# Altium project admin_light_1-0.PrjPcb
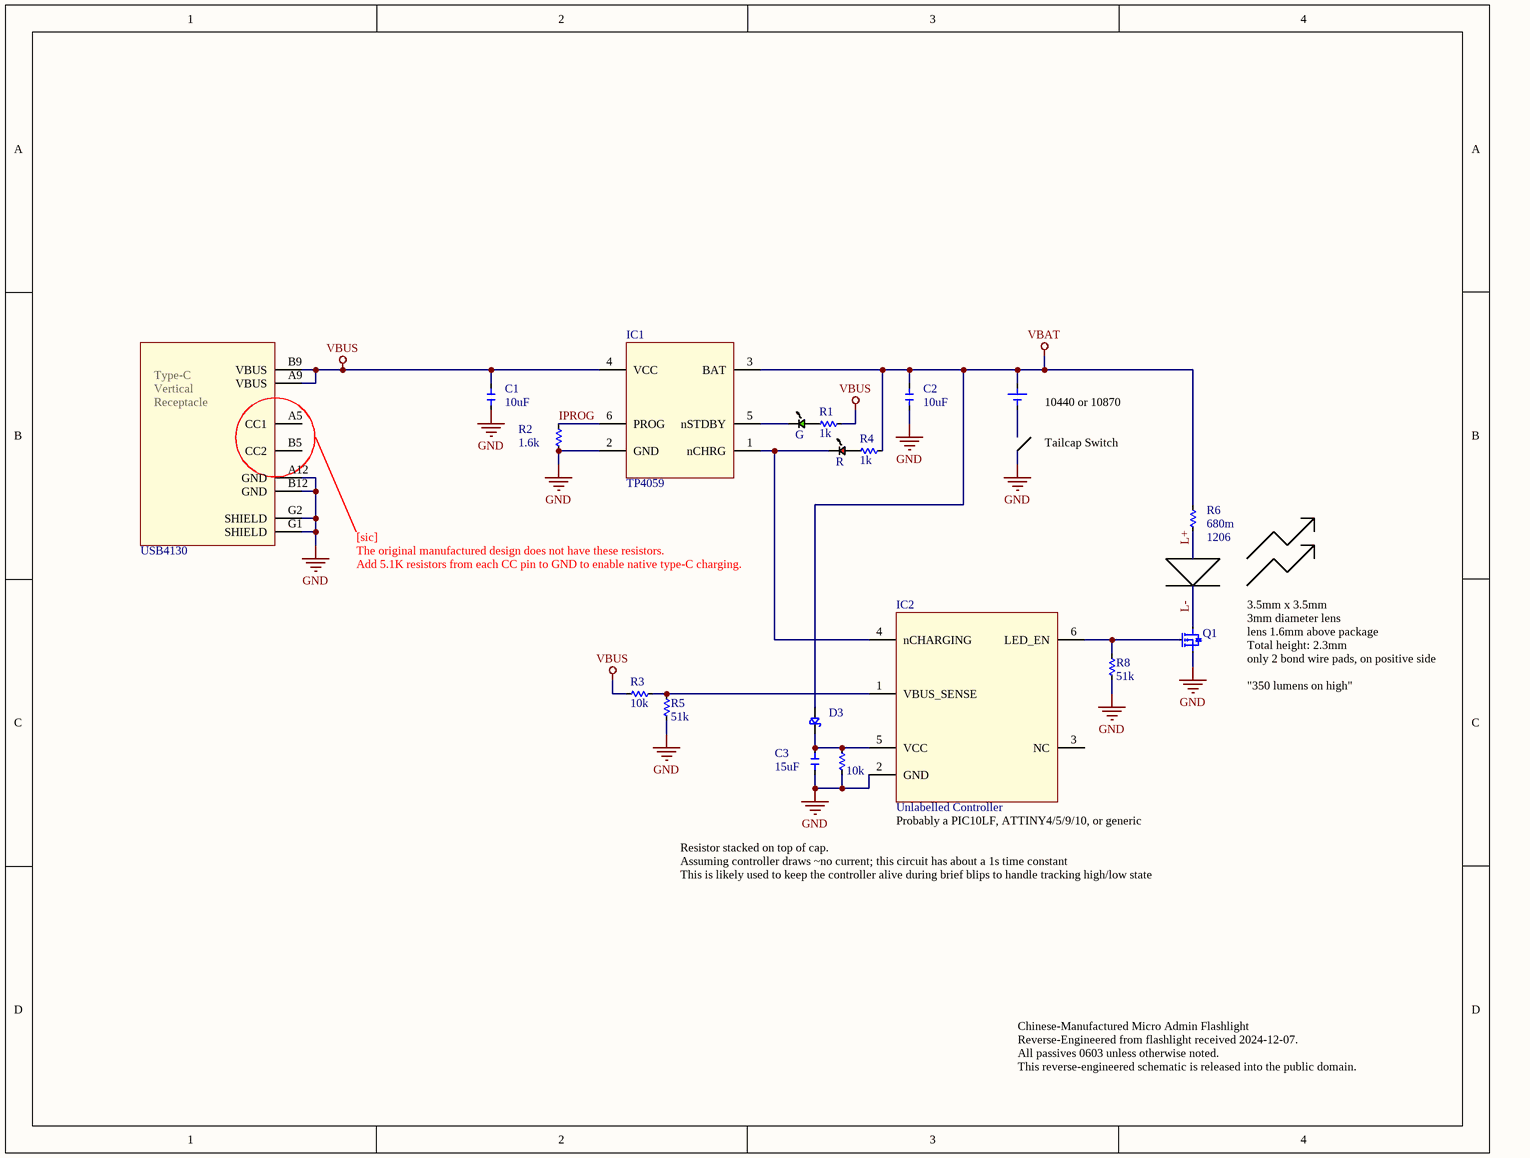
[diagram p0: admin_light.SchDoc]
1 sheet, 19 parts. Net scope: strictly hierarchical (ports join the sheet entries above them; power ports are local).

## Sheet admin_light.SchDoc
size Letter; DocumentNumber: 1; SheetNumber: 1; SheetTotal: 1

### Parts
?  Resistance: 10k  [R0603_0.55MM]  (hidden comment: RC0603FR-0710KL)
BT1  1095P  [BAT_KEYSTONE_1095P]  (value not drawn)
C1  Capacitance: 10uF
C2  Capacitance: 10uF
C3  Capacitance: 15uF
CN?  USB4130
D3  NRVB120VLSFT1G  [SOD123FL_ONSEMI]  (value not drawn)
G  LTST-C193TGKT-5A  [LTST-C193TGKT-5A]  (value not drawn)
IC1  TP4059  [SOT95P290X125-6L]
IC2  Unlabelled Controller
Q1  (no value)
R  LTST-C193KRKT-2A  [LTST-C193KRKT-2A]  (value not drawn)
R1  Resistance: 1k  [R0603_0.55MM]  (hidden comment: RC0603FR-071KL)
R2  Resistance: 1.6k  [R0603_0.55MM]  (hidden comment: RC0603FR-071K6L)
R3  Resistance: 10k  [R0603_0.55MM]  (hidden comment: RC0603FR-0710KL)
R4  Resistance: 1k  [R0603_0.55MM]  (hidden comment: RC0603FR-071KL)
R5  Resistance: 51k  [R0603_0.55MM]  (hidden comment: RC0603FR-0751KL)
R6  Resistance: 680m  Footprint: 1206
R8  Resistance: 51k  [R0603_0.55MM]  (hidden comment: RC0603FR-0751KL)

### Nets
GND: ?.2 C1.2 C2.2 C3.2 CN?.A12(GND) CN?.B12(GND) CN?.G1(SHIELD) CN?.G2(SHIELD) IC1.2(GND) IC2.2(GND) Q1.2 R2.2 R5.2 R8.2
VBAT: BT1.P C2.1 D3.2 IC1.3(BAT) R4.1 R6.1
VBUS: C1.1 CN?.A9(VBUS) CN?.B9(VBUS) IC1.4(VCC) R1.1 R3.1
IPROG: IC1.6(PROG) R2.1  [project net IPROG_1]
L+: R6.2  [project net L+_1]
L-: Q1.3  [project net L-_1]
Net?_1: ?.1 C3.1 D3.1 IC2.5(VCC)
NetG_1: G.1 IC1.5(nSTDBY)
NetG_2: G.2 R1.2
NetIC1_1: IC1.1(nCHRG) IC2.4(nCHARGING) R.1
NetIC2_1: IC2.1(VBUS_SENSE) R3.2 R5.1
NetIC2_6: IC2.6(LED_EN) Q1.1 R8.1
NetR_2: R.2 R4.2

Not connected (* = marked no-connect by the designer): BT1 N(_); CN? A5(CC1) B5(CC2); IC2 3(NC)

### Notes on the sheet
- (near BT1) 10440 or 10870
- (near BT1) Tailcap Switch
- [sic]
- The original manufactured design does not have these resistors.
- Add 5.1K resistors from each CC pin to GND to enable native type-C charging.
- 3.5mm x 3.5mm
- 3mm diameter lens
- lens 1.6mm above package
- Total height: 2.3mm
- only 2 bond wire pads, on positive side
- "350 lumens on high"
- (near IC2) Probably a PIC10LF, ATTINY4/5/9/10, or generic
- Resistor stacked on top of cap.
- Assuming controller draws ~no current; this circuit has about a 1s time constant
- This is likely used to keep the controller alive during brief blips to handle tracking high/low state
- Chinese-Manufactured Micro Admin Flashlight
  Reverse-Engineered from flashlight received 2024-12-07.
  All passives 0603 unless otherwise noted.
  This reverse-engineered schematic is released into the public domain.
- (in symbol USB4130) Type-C; Vertical; Receptacle

### Library data of the parts
? R3 = resistor_standard_1173: RES SMD 10K OHM 1% 1/10W 0603; Manufacturer: Yageo; Unit Price (USD): 0.1; Power (Watts): 0.1W, 1/10W; Temperature Coefficient: ±100ppm/°C; Key: resistor_standard_1173; ComponentLink1Description: Series Datasheet; ComponentLink1URL: https://www.yageo.com/upload/media/product/productsearch/datasheet/rchip/PYu-RC_Group_51_RoHS_L_10.pdf; Digi-Key Part Number: 311-10.0KHRCT-ND; Manufacturer Part Number: RC0603FR-0710KL; Series: RC; Value: 10k; Tolerance: ±1%; Composition: Thick Film; Features: Moisture Resistant; Operating Temperature: -55°C ~ 155°C; Package / Case: 0603 (1608 Metric); Supplier Device Package: 603; Size / Dimension: 0.063" L x 0.031" W (1.60mm x 0.80mm); Height - Seated (Max): 0.022" (0.55mm)
BT1 = BATT_HOLDER_18350_1095P: Cylindrical Battery Contacts, Clips, Holders & Springs 18350 HOLDER THM POLARIZED; Manufacturer: Keystone Electronics; Number of Cells: 1; Battery Size: 18350; Supplier 1: Digikey; Manufacturer Part Number: 1095P; RoHS: Yes; Category: Batteries and Accessories; Stock 1: 467; Pricing 1: 1=3.26, 25=2.7448, 100=2.2695, 250=2.08576, 500=1.95606, 1000=1.82638, 2500=1.65347, 5000=1.49137 (USD); Mounting Technology: Through Hole,PCB; Min Operating Temperature: -50°C; Max Operating Temperature: 145°C; Termination: PC Pin; Series: -; ComponentLink1URL: https://www.keyelco.com/userAssets/file/M65p26.pdf; ComponentLink1Description: Datasheet; Supplier Part Number 1: 36-1095P-ND
C1-C3 = 2pin_nonpolar_capacitor
D3 = DIODE_SCHOTTKY_20V_1A_NRVB120VLSFT1G: Diode Schottky Si 20V 1A Automotive 2-Pin SOD-123FL T/R; Manufacturer: ON Semiconductor; Max Reverse Current: 15mA; Peak Non-Repetitive Surge Current: 45A; Supplier 1: Digikey; Manufacturer Part Number: NRVB120VLSFT1G; RoHS: Yes; Category: Schottky Diodes; Stock 1: 18580; Pricing 1: 1=0.76, 10=0.474, 100=0.3058, 500=0.2331, 1000=0.20965, 3000=0.17979, 6000=0.16473, 9000=0.15705, 15000=0.14842, 21000=0.1433, 30000=0.13832 (USD); Mounting Technology: Surface Mount; Case/Package: SOD; Pins: 2; Min Operating Temperature: -65°C; Max Operating Temperature: 125°C; Packaging: Tape and Reel; Average Rectified Current: 1A; Max Repetitive Reverse Voltage (Vrrm): 20V; Max Reverse Voltage (DC): 20V; Series: Automotive, AEC-Q101; Lead Free: Lead Free; RoHS Compliant: Yes; ComponentLink3URL: http://www.onsemi.com/pub/Collateral/MBR120VLSFT1-D.PDF?src-supplier=Digikey; ComponentLink3Description: Datasheet; Supplier Part Number 1: NRVB120VLSFT1GOSCT-ND
G = LED_GREEN_0603_LTST-C193TGKT-5A: Green 1.6 x 0.8 x 0.8 mm 280 mcd 3.1 V Water Clear Ultra Bright InGaN Chip LED; Manufacturer: Vishay Lite-On; Lens Color: Colorless; Forward Current: 5mA; Forward Voltage: 3.1V; Luminous Intensity: 280mcd; Viewing Angle: 130°; Lens Style: Diffused,Colorless,Rectangular; Dominant Wavelength: 528nm; Number of LEDs: 1; Wavelength: 535nm; Supplier 1: Digikey; Manufacturer Part Number: LTST-C193TGKT-5A; RoHS: Yes; Category: LEDs; Stock 1: 106542; Pricing 1: 1=0.5, 10=0.289, 100=0.1844, 500=0.14328, 1000=0.13069, 2000=0.12039, 5000=0.10957, 10000=0.10307, 15000=0.09983, 25000=0.09625, 35000=0.09416, 50000=0.09216 (USD); Mounting Technology: Surface Mount; Case/Package: 0603; Pins: 2; Color: Green; Case Code (Metric): 1608; Case Code (Imperial): 0603; Min Operating Temperature: -20°C; Max Operating Temperature: 80°C; Illumination Color: Green; Packaging: Tape and Reel; Package Quantity: 3000; Lens Transparency: Clear; Test Current: 5mA; Series: -; Length: 1.6mm; Width: 0.8mm; Height: 0.35mm; Radiation Hardening: No; Lead Free: Lead Free; RoHS Compliant: Yes; ComponentLink1URL: https://datasheet.ciiva.com/2111/ltst-c193tgkt-5a-2111818.pdf?src-supplier=Digikey; ComponentLink1Description: Datasheet; Supplier Part Number 1: 160-1832-1-ND
IC1 = BATT_CHARGER_LINEAR_TP4059: Manufacturer: TOPPOWER; Supplier 1: LCSC; Manufacturer Part Number: TP4059; RoHS: No; Stock 1: 510; Pricing 1: 5=0.1109, 50=0.0894, 150=0.0786, 500=0.0706, 3000=0.0609, 6000=0.0576 (USD); Supplier Part Number 1: C80364; ComponentLink1Description: Datasheet; ComponentLink1URL: http://toppwr.com/uploadfile/file/20240913/66e3a53c397cc.pdf
IC2 = mystery_controller
Q1 = _generic_nfet
R = LED_RED_0603_LTST-C193KRKT-2A: Led 0603 Red 629NM 11MCD 2MA; Manufacturer: Vishay Lite-On; Lens Color: Colorless; Viewing Angle: 130°; Lens Style: Flat; Lens Transparency: Clear; Luminous Intensity: 6.5mcd; Forward Voltage: 1.9V; Lens Size: 0.8mm; Supplier 1: Digikey; Manufacturer Part Number: LTST-C193KRKT-2A; RoHS: Yes; Category: LEDs; Stock 1: 100428; Pricing 1: 1=0.28, 10=0.159, 100=0.0967, 500=0.07258, 1000=0.06521, 2000=0.05917 (USD); Mounting Technology: Surface Mount; Case/Package: 0603; Color: Red; Case Code (Metric): 1608; Case Code (Imperial): 0603; Packaging: Cut Tape; Test Current: 2mA; Dominant Wavelength: 629nm; Series: -; Length: 1.6mm; Width: 0.8mm; Height: 0.35mm; RoHS Compliant: Yes; ComponentLink1URL: https://datasheet.ciiva.com/6348/ltst-c193krkt-2a-6348473.pdf?src-supplier=Digikey; ComponentLink1Description: Datasheet; Supplier Part Number 1: 160-1909-1-ND
R1 R4 = resistor_standard_1131: RES SMD 1K OHM 1% 1/10W 0603; Manufacturer: Yageo; Unit Price (USD): 0.1; Power (Watts): 0.1W, 1/10W; Temperature Coefficient: ±100ppm/°C; Key: resistor_standard_1131; ComponentLink1Description: Series Datasheet; ComponentLink1URL: https://www.yageo.com/upload/media/product/productsearch/datasheet/rchip/PYu-RC_Group_51_RoHS_L_10.pdf; Digi-Key Part Number: 311-1.00KHRCT-ND; Manufacturer Part Number: RC0603FR-071KL; Series: RC; Value: 1k; Tolerance: ±1%; Composition: Thick Film; Features: Moisture Resistant; Operating Temperature: -55°C ~ 155°C; Package / Case: 0603 (1608 Metric); Supplier Device Package: 603; Size / Dimension: 0.063" L x 0.031" W (1.60mm x 0.80mm); Height - Seated (Max): 0.022" (0.55mm)
R2 = resistor_standard_1160: RES SMD 1.6K OHM 1% 1/10W 0603; Manufacturer: Yageo; Unit Price (USD): 0.1; Power (Watts): 0.1W, 1/10W; Temperature Coefficient: ±100ppm/°C; Key: resistor_standard_1160; ComponentLink1Description: Series Datasheet; ComponentLink1URL: https://www.yageo.com/upload/media/product/productsearch/datasheet/rchip/PYu-RC_Group_51_RoHS_L_10.pdf; Digi-Key Part Number: 311-1.60KHRCT-ND; Manufacturer Part Number: RC0603FR-071K6L; Series: RC; Value: 1.6k; Tolerance: ±1%; Composition: Thick Film; Features: Moisture Resistant; Operating Temperature: -55°C ~ 155°C; Package / Case: 0603 (1608 Metric); Supplier Device Package: 603; Size / Dimension: 0.063" L x 0.031" W (1.60mm x 0.80mm); Height - Seated (Max): 0.022" (0.55mm)
R5 R8 = resistor_standard_1579: RES SMD 51K OHM 1% 1/10W 0603; Manufacturer: Yageo; Unit Price (USD): 0.1; Power (Watts): 0.1W, 1/10W; Temperature Coefficient: ±100ppm/°C; Key: resistor_standard_1579; ComponentLink1Description: Series Datasheet; ComponentLink1URL: https://www.yageo.com/upload/media/product/productsearch/datasheet/rchip/PYu-RC_Group_51_RoHS_L_10.pdf; Digi-Key Part Number: 311-51.0KHRCT-ND; Manufacturer Part Number: RC0603FR-0751KL; Series: RC; Value: 51k; Tolerance: ±1%; Composition: Thick Film; Features: Moisture Resistant; Operating Temperature: -55°C ~ 155°C; Package / Case: 0603 (1608 Metric); Supplier Device Package: 603; Size / Dimension: 0.063" L x 0.031" W (1.60mm x 0.80mm); Height - Seated (Max): 0.022" (0.55mm)
R6 = 2pin_resistor

## Assembly variants
0: all parts fitted